# Altium project thietkedientu.PrjPcb
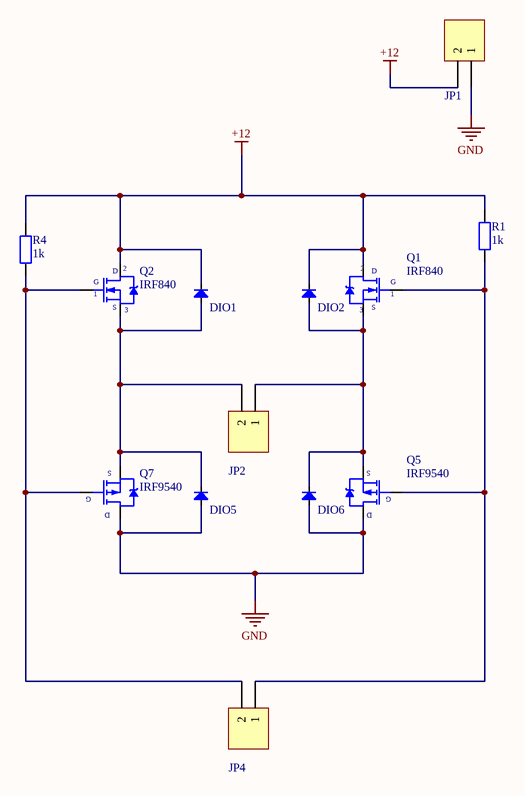
[diagram p0: H bridge.SchDoc]
4 sheets, 48 parts. Net scope: global (net labels, ports and power ports of the same name join across sheets).
Board files: H bridge pcb.PcbDoc, sensorpcb.PcbDoc, nguonPCB.PcbDoc, nguon12pcb.PcbDoc
Sheets:
  H bridge.SchDoc
  sensor.SchDoc
  nguonsche.SchDoc
  nguon12.SchDoc

## Sheet H bridge.SchDoc
size A

### Parts
DIO1  Diode SMD  [DIO-SMD-106]  (value not drawn)
DIO2  Diode SMD  [DIO-SMD-106]  (value not drawn)
DIO5  Diode SMD  [DIO-SMD-106]  (value not drawn)
DIO6  Diode SMD  [DIO-SMD-106]  (value not drawn)
JP1  Header 2_1  [HED2]  (value not drawn)
JP2  Header 2_1  [HED2]  (value not drawn)
JP4  Header 2_1  [HED2]  (value not drawn)
Q1  IRF840  [QTO-220]
Q2  IRF840  [QTO-220]
Q5  IRF9540  [QTO-220]
Q7  IRF9540  [QTO-220]
R1  1k  [R1/4W]
R4  1k  [R1/4W]

### Nets
+12: DIO1.2(K) DIO2.2(K) JP1.2 Q1.2(D) Q2.2(D) R1.2 R4.2
GND: DIO5.1(A) DIO6.1(A) JP1.1 Q5.2(D) Q7.2(D)
NetDIO1_1: DIO1.1(A) DIO5.2(K) JP2.2 Q2.3(S) Q7.3(S)
NetDIO2_1: DIO2.1(A) DIO6.2(K) JP2.1 Q1.3(S) Q5.3(S)
NetJP4_1: JP4.1 Q1.1(G) Q5.1(G) R1.1
NetJP4_2: JP4.2 Q2.1(G) Q7.1(G) R4.1

### Library data of the parts
DIO1 DIO2 DIO5 DIO6 = Diode SMD: Default Diode; Code - JEDEC: DO-214-AB; Value: 1N5007; Published: 8-Jun-2000; Revision: July-2002: Re-released for DXP Platform.; Publisher: Altium Limited
JP1 JP2 JP4 = Header 2_1: Header, 2-Pin; Manufacturer: Generic Components; Class: Connector; Value: Header 2
Q1 Q2 = IRF840: MOSFET N - CHANNEL 500V - 0.75 - 8A - TO-220; Value: IRF840
Q5 Q7 = IRF9540: HEXFET P-Channel Power MOSFET; Note: Pin 2 is electrically connected to pin 4.; Published: 8-Jun-2000; LatestRevisionDate: 17-Jul-2002; LatestRevisionNote: Re-released for DXP Platform.; DatasheetVersion: PD-9.421C; PackageVersion: Feb-1997; PackageReference: TO-220AB; Publisher: Altium Limited; PackageDescription: TO, Thru-Hole, Vertical, Heatsink Mounted; 3 In-Line Leads; Pitch 2.54 mm; ComponentLink1Description: Manufacturer Link; ComponentLink1URL: http://www.irf.com/; ComponentLink2Description: Datasheet; ComponentLink2URL: http://www.irf.com/product-info/datasheets/data/irf9540.pdf
R1 R4 = R1/4W: Resistor 1/4W; Value: R1/4W - 1K

## Sheet sensor.SchDoc
size A
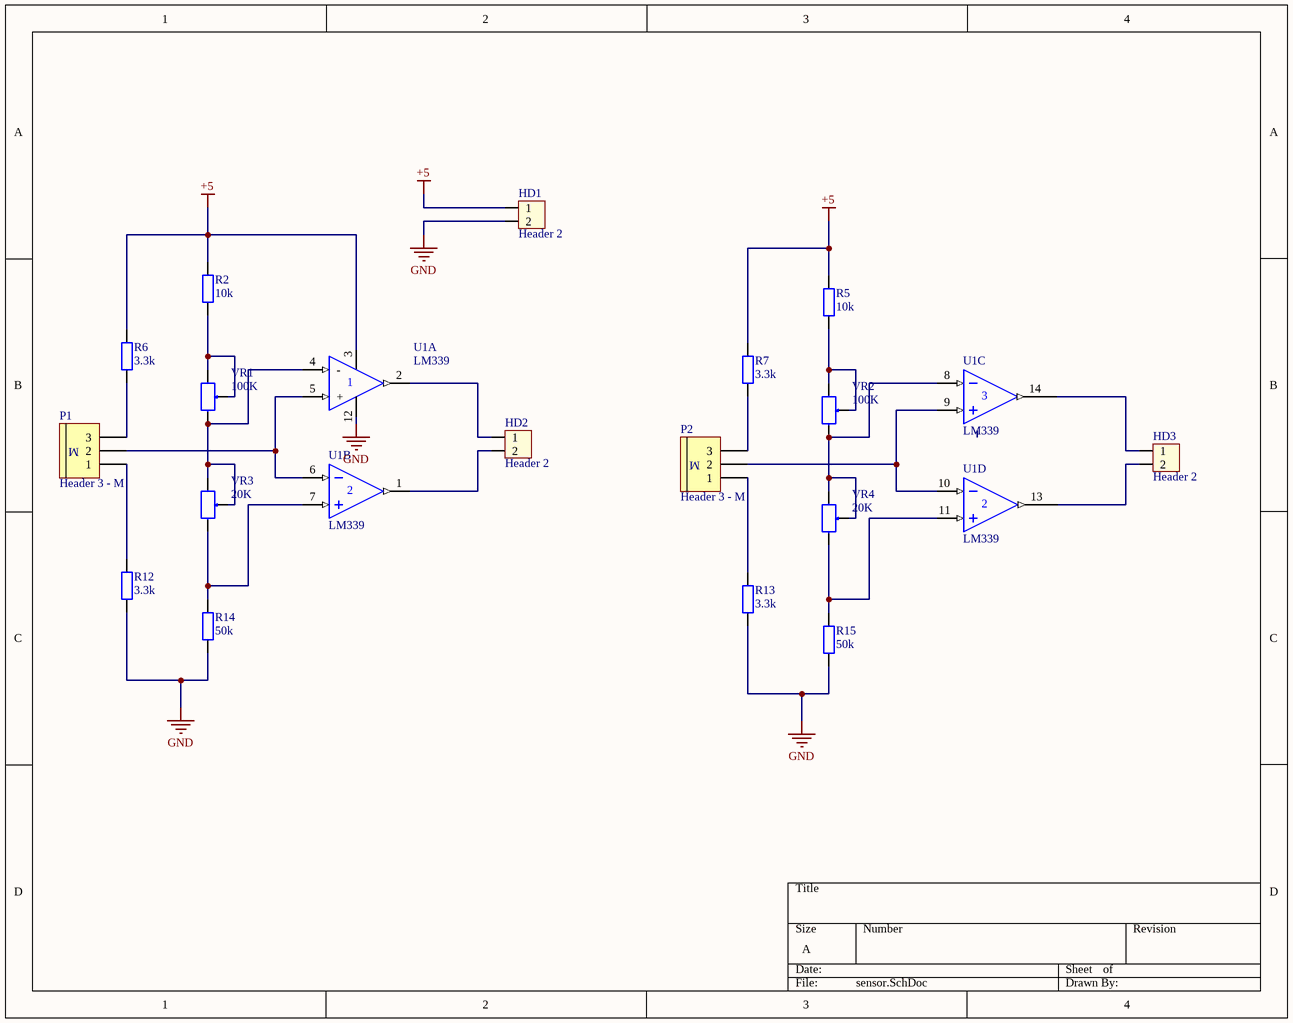
[diagram p1: sensor.SchDoc]

### Parts
HD1  Header 2  [HED2]
HD2  Header 2  [HED2]
HD3  Header 2  [HED2]
P1  Header 3 - M  [Medium - Header 3]
P2  Header 3 - M  [Medium - Header 3]
R2  10k  [R1/4W]
R5  10k  [R1/4W]
R6  3.3k  [R1/4W]
R7  3.3k  [R1/4W]
R12  3.3k  [R1/4W]
R13  3.3k  [R1/4W]
R14  50k  [R1/4W]
R15  50k  [R1/4W]
U1  LM339  [DIP14]  (parts A,B,C,D of 4)
VR1  100K  [VR]
VR2  100K  [VR]
VR3  20K  [VR]
VR4  20K  [VR]

### Nets
+5: HD1.1 R2.2 R5.2 R6.2 R7.2 U1.3(VCC)
GND: HD1.2 R12.1 R13.1 R14.1 R15.1 U1.12(GND)
NetHD2_1: HD2.1 U1.2(OUT)
NetHD2_2: HD2.2 U1.1(OUT)
NetHD3_1: HD3.1 U1.14
NetHD3_2: HD3.2 U1.13
NetP1_1: P1.1 R12.2
NetP1_2: P1.2 U1.5(+) U1.6(IN-)
NetP1_3: P1.3 R6.1
NetP2_1: P2.1 R13.2
NetP2_2: P2.2 U1.9(IN-) U1.10(IN-)
NetP2_3: P2.3 R7.1
NetR2_1: R2.1 VR1.1 VR1.2
NetR5_1: R5.1 VR2.1 VR2.2
NetR14_2: R14.2 U1.7(IN+) VR3.3
NetR15_2: R15.2 U1.11(IN+) VR4.3
NetU1_4: U1.4(-) VR1.3 VR3.1 VR3.2
NetU1_8: U1.8(OUT) VR2.3 VR4.1 VR4.2

### Notes on the sheet
- (in symbol Header 3 - M) M

### Library data of the parts
HD1-HD3 = Hed2: Header 2 (Green); Value: Header 2
P1 P2 = Header 3 - M: Header, 3-Pin, Medium; LatestRevisionDate: 17-Jul-2002; LatestRevisionNote: Re-released for DXP Platform.; Publisher: Altium Limited
R2 R5-R7 R12-R15 = R1/4W: Resistor 1/4W; Value: R1/4W - 1K
U1 = LM339: Low Power Low Offset Voltage Quad Comparators
VR1-VR4 = VR: Var Resistor; Value: VR 10K

## Sheet nguonsche.SchDoc
size A
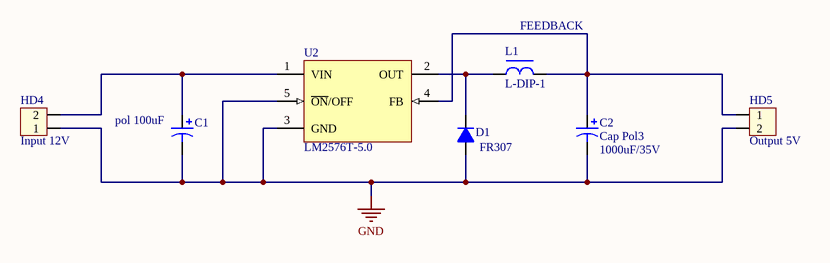
[diagram p2: nguonsche.SchDoc]

### Parts
C1  pol 100uF  [C10mm]
C2  Cap Pol3  value 1000uF/35V  [CP2/5]
D1  FR307  [D2A]
HD4  Input 12V  [HED2]
HD5  Output 5V  [HED2]
L1  L-DIP-1  [L-DIP-M-5.3]
U2  LM2576T-5.0  [LM2576t]

### Nets
GND: C1.2 C2.2 D1.1(A) HD4.1 HD5.2 U2.3(GND) U2.5(~{ON}/OFF)
NetC1_1: C1.1 HD4.2 U2.1(VIN)
NetC2_1: C2.1 HD5.1 L1.2 U2.4(FB)
NetD1_2: D1.2(K) L1.1 U2.2(OUT)

### Notes on the sheet
- (near L1) FEEDBACK

### Library data of the parts
C1 = Cap Pol 12mm: Polarized Capacitor (Axial); Published: 8-Jun-2000; LatestRevisionDate: 17-Jul-2002; LatestRevisionNote: Re-released for DXP Platform.; PackageReference: POLAR0.8; Publisher: Altium Limited
C2 = Cap Pol3: Polarized Capacitor (Surface Mount); VALUE: C?; LatestRevisionDate: 17-Jul-2002; LatestRevisionNote: Re-released for DXP Platform.; PackageReference: C0805; Publisher: Altium Limited
D1 = D1A: Diode 1A; Value: 1N4007
HD4 HD5 = Hed2: Header 2 (Green); Value: Header 2
L1 = L-DIP-1: Inductor; Value: 150 mH
U2 = LM2576T-5.0: SIMPLE SWITCHER; 3A Step-Down Voltage Regulator; Manufacturer: National Semiconductor; PackageTopMarking: NSUZXYTT*LM2576T*-5.0 P+; PowerWise: N; FirstPublished: 4-Dec-2008; DatasheetVersion: Aug-2004; PackageVersion: revJ, Jan-1992; PackageReference: T05A; Publisher: Altium Limited; PackageDescription: TO-220, Molded, 5 Lead, Straight; CompType: Switcher; PartNumber: LM2576T-5.0; RoHS: O; PinCount: 5; DigiKeyPartNumber: LM2576T-5.0-ND; Code_JEDEC: TO-220-AB; ComponentLink1Description: LM2576 Datasheet; ComponentLink1URL: http://www.national.com/ds/LM/LM2576.pdf; ComponentLink2Description: LM2576 Web Page; ComponentLink2URL: http://www.national.com/pf/LM/LM2576.html; ComponentLink3Description: T05A Package Page; ComponentLink3URL: http://www.national.com/packaging/folders/t05a.html

## Sheet nguon12.SchDoc
size A
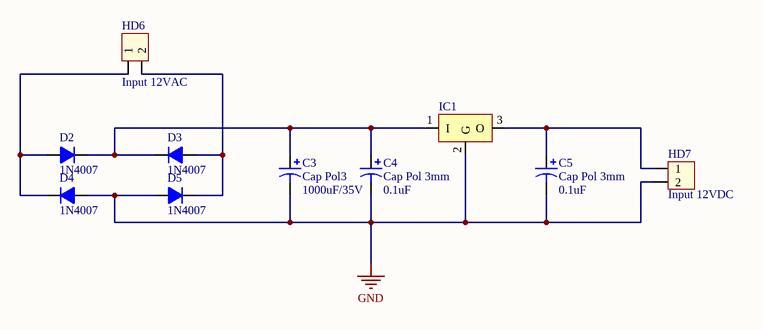
[diagram p3: nguon12.SchDoc]

### Parts
C3  Cap Pol3  value 1000uF/35V  [CP2/5]
C4  Cap Pol 3mm  [C3MM]
C5  Cap Pol 3mm  [C3MM]
D2  1N4007  [D2A]
D3  1N4007  [D2A]
D4  1N4007  [D2A]
D5  1N4007  [D2A]
HD6  Input 12VAC  [HED2]
HD7  Input 12VDC  [HED2]
IC1  LM78xx  [TO220-123]  (value not drawn)

### Nets
GND: C3.2 C4.2 C5.2 D4.1(A) D5.1(A) HD7.2 IC1.2(G)
NetC3_1: C3.1 C4.1 D2.2(K) D3.2(K) IC1.1(I)
NetC5_1: C5.1 HD7.1 IC1.3(O)
NetD2_1: D2.1(A) D4.2(K) HD6.1
NetD3_1: D3.1(A) D5.2(K) HD6.2

### Notes on the sheet
- (in symbol Cap Pol 3mm) 0.1uF

### Library data of the parts
C3 = Cap Pol3: as C2 on sheet nguonsche; LatestRevisionDate: 17-Jul-2002; LatestRevisionNote: Re-released for DXP Platform.; PackageReference: C0805; Publisher: Altium Limited
C4 C5 = Cap Pol 3mm: Polarized Capacitor (Axial); Published: 8-Jun-2000; LatestRevisionDate: 17-Jul-2002; LatestRevisionNote: Re-released for DXP Platform.; PackageReference: POLAR0.8; Publisher: Altium Limited
D2-D5 = D1A: Diode 1A; Value: 1N4007
HD6 HD7 = Hed2: Header 2 (Green); Value: Header 2
IC1 = LM78xx: Positive Voltage Regulator; Note: Tab is connected to pin 3 (GND).; Published: 24-Aug-2001; LatestRevisionDate: 17-Jul-2002; LatestRevisionNote: Re-released for DXP Platform.; DatasheetVersion: Apr-1994; PackageVersion: Jul-1998; PackageReference: ISOWATT220AB; Publisher: Altium Limited; PackageDescription: TO, Thru-Hole, Vertical, Heatsink Mounted; 3 In-Line Leads; Pitch 2.54 mm; Pin sequence 1, 3, 2; ComponentLink1Description: Manufacturer Link; ComponentLink1URL: http://www.st.com/; ComponentLink2Description: Datasheet; ComponentLink2URL: http://www.st.com/stonline/products/literature/ds/2146/l78m05c.pdf

## Nets that join several sheets
GND: H bridge (5 pins), sensor (6 pins), nguonsche (7 pins), nguon12 (7 pins)